# EAGLE design epic2 (EAGLE 6.5.0)
AUTHOR: Brad Campbell; REVISION: A; TITLE: Myth

## Sheet 1 of 2
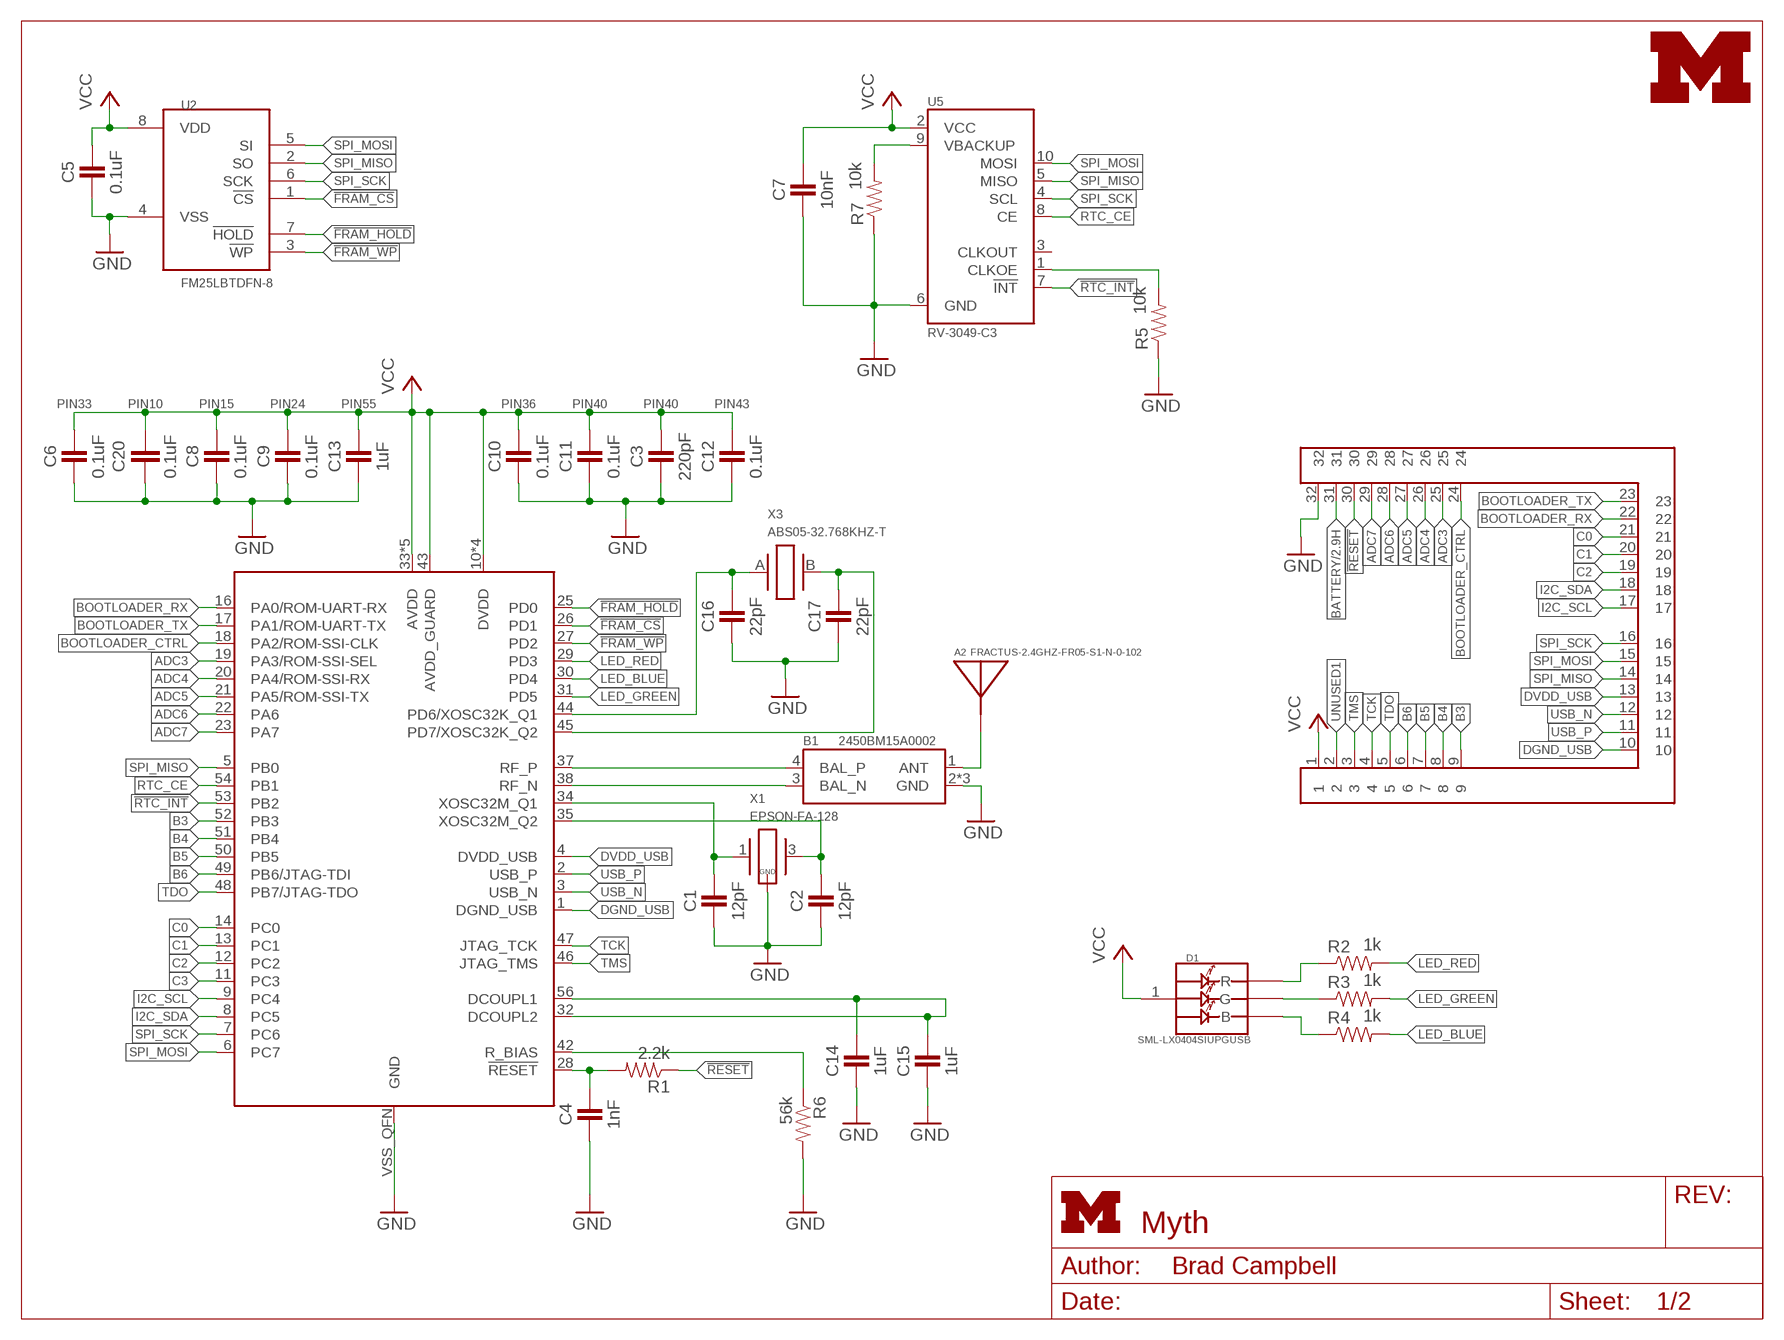
[diagram p0: schematic, sheet 1]
FRAME1 (LETTER_L): HEIGHT: 8.5in; WIDTH: 11in

### Parts
A2  FRACTUS-2.4GHZ-FR05-S1-N-0-102  [FRACTUS-ANTENNA-FR05-S1-N-0-102]
B1  2450BM15A0002  [2450BM]
C1  12pF  CAPACITOR  [0402_CAP]
C2  12pF  CAPACITOR  [0402_CAP]
C3  220pF  CAPACITOR  [0402_CAP]
C4  1nF  CAPACITOR  [0402_CAP]
C5  0.1uF  CAPACITOR  [0402_CAP]
C6  0.1uF  CAPACITOR  [0402_CAP]
C7  10nF  CAPACITOR  [0402_CAP]
C8  0.1uF  CAPACITOR  [0402_CAP]
C9  0.1uF  CAPACITOR  [0402_CAP]
C10  0.1uF  CAPACITOR  [0402_CAP]
C11  0.1uF  CAPACITOR  [0402_CAP]
C12  0.1uF  CAPACITOR  [0402_CAP]
C13  1uF  CAPACITOR  [0402_CAP]
C14  1uF  CAPACITOR  [0402_CAP]
C15  1uF  CAPACITOR  [0402_CAP]
C16  22pF  CAPACITOR  [0402_CAP]
C17  22pF  CAPACITOR  [0402_CAP]
C20  0.1uF  C-EUC0201  [C0201]
D1  SML-LX0404SIUPGUSB  [1MM_SQ_4PAD]
J1  EPIC2-HEADER2  [EPIC2-HEADER2]
LOGO1  UMICH_SOLID_TINY  [UMICH_SOLID_50MIL]
R1  2.2k  RESISTOR  [0402_RES]
R2  1k  RESISTOR  [0402_RES]
R3  1k  RESISTOR  [0402_RES]
R4  1k  RESISTOR  [0402_RES]
R5  10k  RESISTOR  [0402_RES]
R6  56k  RESISTOR  [0402_RES]
R7  10k  RESISTOR  [0402_RES]
U2  FM25LBTDFN-8  [TDFN-8]
U3  CC2538  [S-PVQFN-N56]
U5  RV-3049-C3  [MICRO-CRYSTAL-C3]
X1  EPSON-FA-128  [FA-128]
X3  ABS05-32.768KHZ-T  [ABS05]

### Nets
!FRAM_CS: U2.1(!CS) U3.26(PD1)
!FRAM_HOLD: U2.7(!HOLD) U3.25(PD0)
!FRAM_WP: U2.3(!WP) U3.27(PD2)
!RESET: J1.30 R1.1
!RTC_INT: U3.53(PB2) U5.7(!INT)
ADC3: J1.25 U3.19(PA3/ROM-SSI-SEL)
ADC4: J1.26 U3.20(PA4/ROM-SSI-RX)
ADC5: J1.27 U3.21(PA5/ROM-SSI-TX)
ADC6: J1.28 U3.22(PA6)
ADC7: J1.29 U3.23(PA7)
ANTENNA: A2.1(ANTENNA) B1.1(ANT)
B3: J1.9 U3.52(PB3)
B4: J1.8 U3.51(PB4)
B5: J1.7 U3.50(PB5)
B6: J1.6 U3.49(PB6/JTAG-TDI)
BATTERY: J1.31 ; also sheet 2
BOOTLOADER_CTRL: J1.24 U3.18(PA2/ROM-SSI-CLK)
BOOTLOADER_RX: J1.22 U3.16(PA0/ROM-UART-RX)
BOOTLOADER_TX: J1.23 U3.17(PA1/ROM-UART-TX)
C0: J1.21 U3.14(PC0)
C1: J1.20 U3.13(PC1)
C2: J1.19 U3.12(PC2)
C3: U3.11(PC3)
DGND_USB: J1.10 U3.1(DGND_USB)
DVDD_USB: J1.13 U3.4(DVDD_USB)
GND: B1.2(GND) B1.5(GND) B1.6(GND) C1.2 C2.2 C3.2 C4.2 C5.2 C6.2 C7.2 C8.2 C9.2 C10.2 C11.2 C12.2 C13.2 C14.2 C15.2 C16.2 C17.2 C20.2 J1.32 R5.1 R6.2 R7.1 U2.4(VSS) U3.VSS_QFN(GND) U5.6(GND) X1.2(GND) X1.4(GND) ; also sheet 2
I2C_SCL: J1.17 U3.9(PC4)
I2C_SDA: J1.18 U3.8(PC5)
LED_BLUE: R4.2 U3.30(PD4)
LED_GREEN: R3.2 U3.31(PD5)
LED_RED: R2.2 U3.29(PD3)
N$1: C4.1 R1.2 U3.28(!RESET)
N$6: C16.1 U3.44(PD6/XOSC32K_Q1) X3.A
N$7: D1.2(R) R2.1
N$8: R6.1 U3.42(R_BIAS)
N$9: C1.1 U3.34(XOSC32M_Q1) X1.1
N$10: C2.1 U3.35(XOSC32M_Q2) X1.3
N$11: D1.4(G) R3.1
N$12: D1.3(B) R4.1
N$13: C17.1 U3.45(PD7/XOSC32K_Q2) X3.B
N$14: R7.2 U5.9(VBACKUP)
N$15: C14.1 C15.1 U3.32(DCOUPL2) U3.56(DCOUPL1)
N$16: R5.2 U5.1(CLKOE)
RF_N: B1.3(BAL_N) U3.38(RF_N)
RF_P: B1.4(BAL_P) U3.37(RF_P)
RTC_CE: U3.54(PB1) U5.8(CE)
SPI_MISO: J1.14 U2.2(SO) U3.5(PB0) U5.5(MISO)
SPI_MOSI: J1.15 U2.5(SI) U3.6(PC7) U5.10(MOSI)
SPI_SCK: J1.16 U2.6(SCK) U3.7(PC6) U5.4(SCL)
TCK: J1.4 U3.47(JTAG_TCK)
TDO: J1.5 U3.48(PB7/JTAG-TDO)
TMS: J1.3 U3.46(JTAG_TMS)
UNUSED1: J1.2
USB_N: J1.12 U3.3(USB_N)
USB_P: J1.11 U3.2(USB_P)
VCC: C3.1 C5.1 C6.1 C7.1 C8.1 C9.1 C10.1 C11.1 C12.1 C13.1 C20.1 D1.1(VDD) J1.1 U2.8(VDD) U3.10(DVDD) U3.15(DVDD) U3.24(DVDD) U3.33(AVDD) U3.36(AVDD) U3.39(AVDD) U3.40(AVDD) U3.41(AVDD) U3.43(AVDD_GUARD) U3.55(DVDD) U5.2(VCC) ; also sheet 2
Unconnected: U5.3(CLKOUT)

### Notes on the sheet
- PIN33 | PIN10 | PIN15 | PIN24 | PIN55 | PIN36 | PIN40 | PIN40 | PIN43

## Sheet 2 of 2
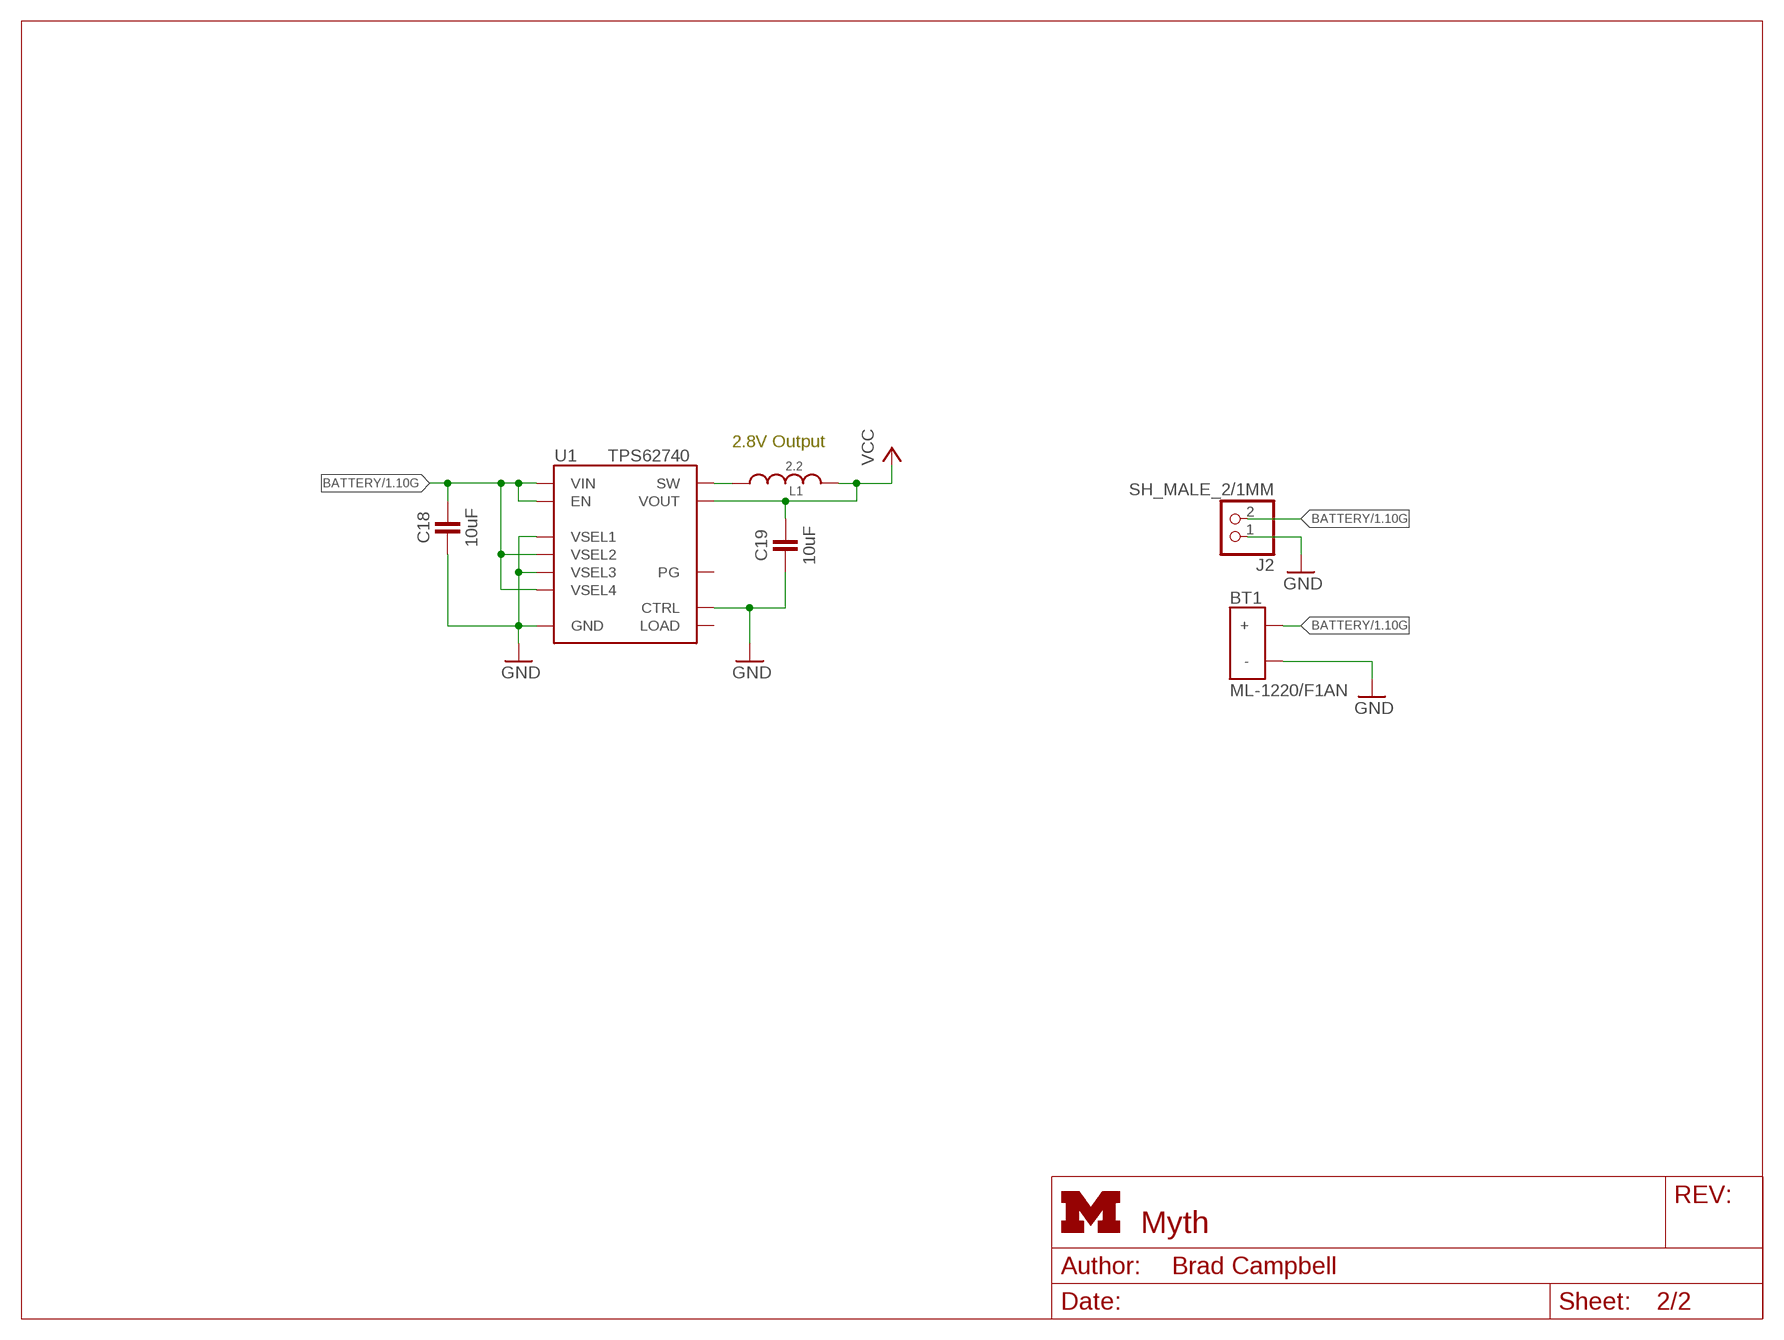
[diagram p1: schematic, sheet 2]
FRAME2 (LETTER_L): HEIGHT: 8.5in; WIDTH: 11in

### Parts
BT1  ML-1220/F1AN  [ML-1220/F1BN]
C18  10uF  CAPACITOR0603_CAP  [0603_CAP]
C19  10uF  CAPACITOR0603_CAP  [0603_CAP]
J2  SH_MALE_2/1MM  [SH-1X2/1MM]
L1  2.2  MIPSZ2012D  [MIPSZ201D]
U1  TPS62740  [R-PWSON-12]

### Nets
BATTERY: BT1.POS(+) C18.1 J2.2 U1.1(VIN) U1.8(VSEL4) U1.10(VSEL2) U1.12(EN) ; also sheet 1
GND: BT1.NEG(-) C18.2 C19.2 J2.1 U1.3(GND) U1.4(CTRL) U1.9(VSEL3) U1.11(VSEL1) U1.NC(GND) ; also sheet 1
N$5: L1.1 U1.2(SW)
VCC: C19.1 L1.2 U1.5(VOUT) ; also sheet 1
Unconnected: U1.6(LOAD) U1.7(PG)

### Notes on the sheet
- 2.8V Output

## Library data of the parts
A2 = chips:FRACTUS-2.4GHZ-FR05-S1-N-0-102: Fractus Compact Reach XtendTM chip antenna is engineered specifically for Bluetooth, WLAN 802.11 b/g/n and other wireless devices operating at the ISM 2.4 GHz band. Compact Reach Xtend combines small form factor size and high performance to improve the functionality of your wireless devices.; RICHARDSON_RFPD: FR05-S1-N-0102B
B1 = chips:2450BM15A0002: BALUN JTI MATCHED ZIGBEE; DIGIKEY: 712-1536-1-ND
BT1 = batteries:ML-1220/F1AN: BATTERY LITH 3V RECHARGE PC PINS; DIGIKEY: P663-nd; MOUSER: 658-ML-1220/F1BN
C1-C17 = passives:CAPACITOR: 0402 Capacitor
C18 = passives:CAPACITOR: 0402 Capacitor; DIGIKEY: 490-7316-1-ND
C19 = passives:CAPACITOR: 0402 Capacitor; DIGIKEY: 1276-1119-1-ND
C20 = rcl:C-EU: CAPACITOR, European symbol
D1 = leds:SML-LX0404SIUPGUSB: 1mm^2 RGB LED; DIGIKEY: 67-2125-1-ND
J1 = epic2:EPIC2-HEADER2
J2 = headers:SH_MALE_2/1MM: 1.0mm pitch/Disconnectable Crimp style connectors; DIGIKEY: 455-1788-2-ND
L1 = passives:MIPSZ2012D: FDK Multi-layer Power Inductor : MIPSZ2012D series (Very Small Type)
LOGO1 = logos:UMICH_SOLID
R1-R7 = passives:RESISTOR: Resistor Basic schematic elements and footprints for 0603, 1206, and PTH resistors.
U1 = chips:TPS62740: 360nA Step Down Converter for Low Power Applications; DIGIKEY: 296-37134-1-ND; MOUSER: 595-TPS62740DSST; NEWARK: 27X9745
U2 = chips:FM25LB: IC FRAM 4KBIT 10MHZ 8SOIC; DIGIKEY: FM25L04B-DGRA-ND; MOUSER: 877-FM25L04B-DG
U3 = chips:CC2538: A Powerful System-On-Chip for 2.4-GHz IEEE 802.15.4, 6LoWPAN and ZigBee Applications; DIGIKEY: 296-35797-1-ND; MOUSER: 595-CC2538SF53RTQT; NEWARK: 87W7713
U5 = chips:RV-3049-C3: The RV-3049-C3 is an ultra miniature Real-Time-Clock Module with embedded Crystal. This RTC has an SPI Bus (4-wire Serial- Interface) and offers temperature compensated time.
X1 = crystals:EPSON-FA-128: MHz RANGE CRYSTAL UNIT ULTRA MINIATURE SIZE LOW PROFILE SMD http://www.digikey.com/product-search/en?FV=ffec63d1
X3 = crystals:ABS05-32.768KHZ: 32.768kHz Crystal; DIGIKEY: 535-11899-1-ND

## Board
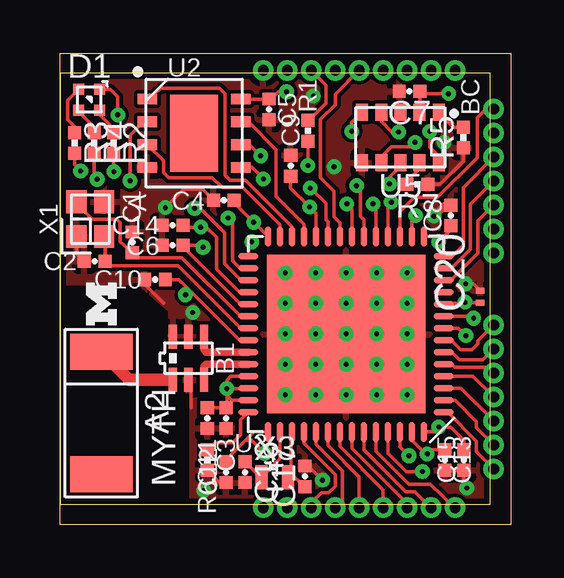
[diagram p2: board, top side]
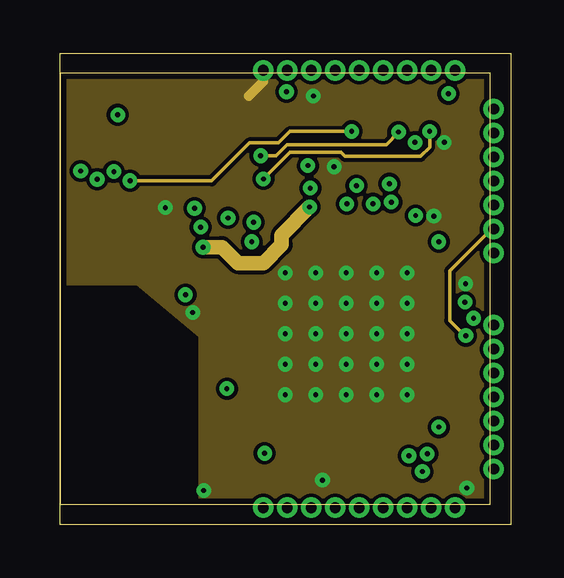
[diagram p3: board, inner layer Route2]
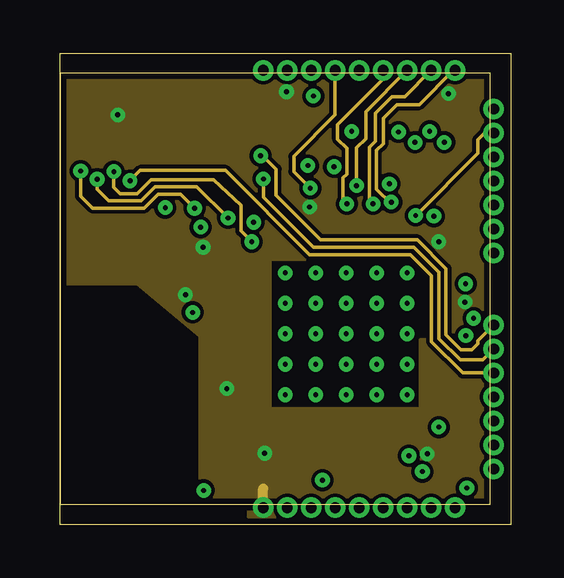
[diagram p4: board, inner layer Route15]
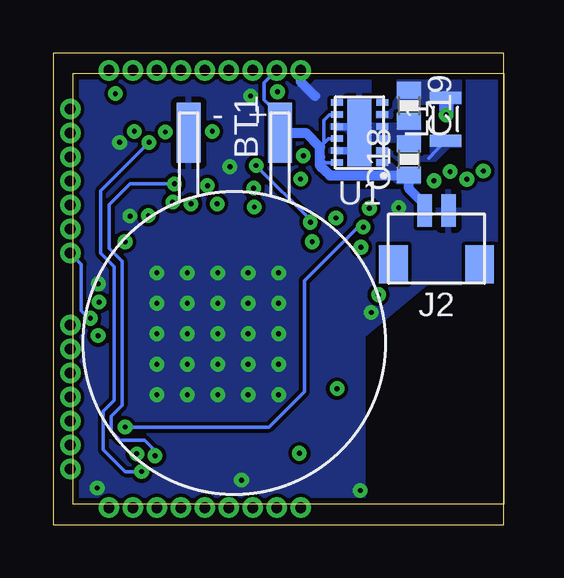
[diagram p5: board, bottom side, seen from below]

Size 17.96 x 17.96 mm. Coordinates in mm from the lower left corner, seen from the top.
Outline: 0,0 17.96,0 17.96,17.96 0,17.96 0,0
Copper layers (1+2*15+16): Top 0.0178mm / dielectric 12mil / Route2 0.0356mm / dielectric 28mil / Route15 0.0356mm / dielectric 12mil / Bottom 0.0178mm
Design rules "sunstone-4lyr_v1.0.0.3 *": minimum track width 6mil, minimum drill 8mil, track to track 6mil, track to pad 6mil, pad to pad 6mil, via to via 6mil, smd to smd 6mil, copper to edge 10mil, drill to drill 16mil, minimum pad ring 8mil, minimum via ring 8mil, stop-mask expansion 3mil, vias tented up to drill 8mil, thermal gap 10mil
Milling: 4 lines

### Footprints (pad centres in the part's own frame; a part is rotated, then mirrored left to right if it is on the bottom)
FRACTUS-ANTENNA-FR05-S1-N-0-102 = smd 1.5 x 2.6: 1 -2.55,0; 2 2.55,0
2450BM = smd 0.35 x 1: 1 0.65,0.9; 2 0,0.9; 3 -0.65,0.9; 4 -0.65,-0.9; 5 0,-0.9; 6 0.65,-0.9
ML-1220/F1BN = smd 2.5 x 1: NEG 8.75,1.9; POS 8.75,-1.9
0402_CAP = smd 0.536 x 0.546: 1 -0.433,0; 2 0.433,0
0603_CAP = smd 0.7 x 1: 1 -0.65,0; 2 0.65,0
C0201 = smd 0.25 x 0.35: 1 -0.25,0; 2 0.25,0
1MM_SQ_4PAD = smd 0.457 x 0.457: 1 0.432,0.432; 2 0.432,-0.432; 3 -0.432,-0.432; 4 -0.432,0.432
EPIC2-HEADER2 = drill 0.45 pad 0.8: 1 -9.479,-9.112; 2 -8.479,-9.112; 3 -7.479,-9.112; 4 -6.479,-9.112; 5 -5.479,-9.112; 6 -4.479,-9.112; 7 -3.479,-9.112; 8 -2.479,-9.112; 9 -1.479,-9.112; 10 0.133,-7.5; 11 0.133,-6.5; 12 0.133,-5.5; 13 0.133,-4.5; 14 0.133,-3.5; 15 0.133,-2.5; 16 0.133,-1.5; 17 0.133,1.5; 18 0.133,2.5; 19 0.133,3.5; 20 0.133,4.5; 21 0.133,5.5; 22 0.133,6.5; 23 0.133,7.5; 24 -1.479,9.112; 25 -2.479,9.112; 26 -3.479,9.112; 27 -4.479,9.112; 28 -5.479,9.112; 29 -6.479,9.112; 30 -7.479,9.112; 31 -8.479,9.112; 32 -9.479,9.112
SH-1X2/1MM = smd 0.6 x 1.35: 1 -0.5,0.1; 2 0.5,0.1 | smd 1.2 x 1.6: SUPPORT1 -1.8,2.335; SUPPORT2 1.8,2.335
MIPSZ201D = smd 0.5 x 1.3: 1 -0.9,0; 2 0.9,0
0402_RES = smd 0.536 x 0.546: 1 -0.433,0; 2 0.433,0
R-PWSON-12 = smd 0.28 x 0.5: 1 -1.25,-0.95; 2 -0.75,-0.95; 3 -0.25,-0.95; 4 0.25,-0.95; 5 0.75,-0.95; 6 1.25,-0.95; 7 1.25,0.95; 8 0.75,0.95; 9 0.25,0.95; 10 -0.25,0.95; 11 -0.75,0.95; 12 -1.25,0.95 | smd 2.8 x 1: NC 0,0
TDFN-8 = smd 0.45 x 0.8: 1 -1.425,-1.95; 2 -0.475,-1.95; 3 0.475,-1.95; 4 1.425,-1.95; 5 1.425,1.95; 6 0.475,1.95; 7 -0.475,1.95; 8 -1.425,1.95 | smd 3.2 x 2: NC 0,0
S-PVQFN-N56 = smd 0.85 x 0.28: 1 -4.075,3.25; 2 -4.075,2.75; 3 -4.075,2.25; 4 -4.075,1.75; 5 -4.075,1.25; 6 -4.075,0.75; 7 -4.075,0.25; 8 -4.075,-0.25; 9 -4.075,-0.75; 10 -4.075,-1.25; 11 -4.075,-1.75; 12 -4.075,-2.25; 13 -4.075,-2.75; 14 -4.075,-3.25; 29 4.075,-3.25; 30 4.075,-2.75; 31 4.075,-2.25; 32 4.075,-1.75; 33 4.075,-1.25; 34 4.075,-0.75; 35 4.075,-0.25; 36 4.075,0.25; 37 4.075,0.75; 38 4.075,1.25; 39 4.075,1.75; 40 4.075,2.25; 41 4.075,2.75; 42 4.075,3.25 | smd 0.28 x 0.85: 15 -3.25,-4.075; 16 -2.75,-4.075; 17 -2.25,-4.075; 18 -1.75,-4.075; 19 -1.25,-4.075; 20 -0.75,-4.075; 21 -0.25,-4.075; 22 0.25,-4.075; 23 0.75,-4.075; 24 1.25,-4.075; 25 1.75,-4.075; 26 2.25,-4.075; 27 2.75,-4.075; 28 3.25,-4.075; 43 3.25,4.075; 44 2.75,4.075; 45 2.25,4.075; 46 1.75,4.075; 47 1.25,4.075; 48 0.75,4.075; 49 0.25,4.075; 50 -0.25,4.075; 51 -0.75,4.075; 52 -1.25,4.075; 53 -1.75,4.075; 54 -2.25,4.075; 55 -2.75,4.075; 56 -3.25,4.075 | smd 6.6 x 6.6: VSS_QFN 0,0
MICRO-CRYSTAL-C3 = smd 0.5 x 0.7: 1 -1.6,-1.05; 2 -0.8,-1.05; 3 0,-1.05; 4 0.8,-1.05; 5 1.6,-1.05; 6 1.6,1.05; 7 0.8,1.05; 8 0,1.05; 9 -0.8,1.05; 10 -1.6,1.05
FA-128 = smd 0.95 x 0.85: 1 -0.725,-0.575; 2 0.725,-0.575; 3 0.725,0.575; 4 -0.725,0.575
ABS05 = smd 0.5 x 1: A -0.55,0; B 0.55,0

### Placement (x,y rotation side)
A2  1.73,3.81 270 top
B1  5.36,6.09 180 top
BT1  11.25,6.73 90 bottom
C1  3.02,10.92 90 top
C2  1.45,10.13 180 top
C3  6.93,3.6 270 top
C4  6.83,12.67 180 top
C5  8.71,16.46 270 top
C6  4.7,10.79 180 top
C7  14.58,17.22 180 top
C8  16.31,12.04 90 top
C9  9.62,14.12 90 top
C10  3.96,9.37 180 top
C11  6.15,3.6 270 top
C12  6.93,1.35 270 top
C13  16.05,1.85 270 top
C14  4.7,11.63 180 top
C15  16.85,1.85 270 top
C16  7.72,1.35 270 top
C17  10.21,1.17 90 top
C18  3.96,14.38 90 bottom
C19  3.96,16.61 270 bottom
C20  17.53,8.66 90 top
D1  1.22,16.87 0 top
J1  17.96,8.98 0 top
J2  2.82,12.34 180 bottom
L1  2.44,16.05 90 bottom
LOGO1  1.73,8.36 90 top
R1  10.34,15.57 270 top
R2  2.24,15.06 270 top
R3  0.61,15.06 270 top
R4  1.42,15.06 270 top
R5  16.81,15.29 90 top
R6  6.15,1.85 270 top
R7  14.91,13.34 180 top
U1  6.02,15.49 90 bottom
U2  5.6,15.47 270 top
U3  11.93,7.09 180 top
U5  14.2,15.29 180 top
X1  1.27,11.89 270 top
X3  8.97,1.14 0 top

### Tracks (layer width: path | path; a pad name or v marks a point on that pad's centre or on a via)
!FRAM_CS
  Top 0.152: U3.26 9.68,11.58 7.75,13.51 7.09,13.51 6.88,13.72 6.88,17.12 6.66,17.35 4.23,17.35 U2.1
!FRAM_HOLD
  Top 0.152: U3.25 10.19,11.68 9.02,12.85 9.02,14.78 7.86,15.94 U2.7
!FRAM_WP
  Top 0.152: U2.3 4.32,14.32 4.32,13.82 4.52,13.61 6.35,13.61 6.76,13.21 7.62,13.21 9.18,11.65 U3.27
!RESET
  Top 0.152: R1.1 10.39,16 11.1,16.71 11.1,17.47 J1.30
!RTC_INT  (via drill 0.2)
  Top 0.152: U3.53 13.68,2.14 14.45,1.37 v15.11,1.37 | U5.7 13.4,14.49 13.82,14.91 14.63,14.91 v14.81,15.09
  Bottom 0.152: v15.11,1.37 15.8,1.37 16.71,2.29 16.71,3.89 16.26,4.34 16.26,9.91 16.82,10.46 16.82,13.08 v14.81,15.09
ADC3  (via drill 0.2)
  Top 0.152: U3.19 13.18,12.4 v13.06,12.52
  Route15 0.152: v13.06,12.52 12.9,12.68 12.9,14.88 13.16,15.14 13.16,16.31 13.84,16.99 14.38,16.99 J1.25
ADC4  (via drill 0.2)
  Top 0.152: U3.20 12.68,11.86 12.52,12.01 12.52,13.13 v12.37,13.28
  Route15 0.152: v12.37,13.28 12.37,14.86 12.75,15.24 12.75,16.36 J1.26
ADC5  (via drill 0.2)
  Top 0.152: U3.21 12.18,12.31 v11.96,12.52
  Route15 0.152: v11.96,12.52 11.81,12.68 11.81,13.61 11.96,13.77 11.96,14.83 11.58,15.21 11.58,15.82 13.48,17.72 J1.27
ADC6
  Top 0.152: U3.22 11.68,11.74 11.43,11.99 11.43,13.06 10.87,13.61 10.87,16.05 11.48,16.66 11.48,17.09 J1.28
ADC7  (via drill 0.2)
  Top 0.152: U3.23 11.18,11.78 11.1,11.86 11.1,12.55 v10.44,13.18 | 11.35,17.97 J1.29
  Route15 0.152: v10.44,13.18 9.75,13.87 9.75,14.5 11.48,16.23 J1.29
ANTENNA
  Top 0.254: B1.1 4.56,5.19
  Top 0.531: A2.1 2.89,5.19 4.56,5.19
B3
  Top 0.152: U3.52 13.18,2.21 14.55,0.84 15.44,0.84 J1.9
B4
  Top 0.152: U3.51 12.68,2.28 14.43,0.53 14.81,0.53 J1.8
B5
  Top 0.152: U3.50 12.18,2.35 14.48,0.05 J1.7
B6
  Top 0.152: U3.49 11.68,2.42 13.48,0.62 J1.6
BATTERY
  Bottom 0.152: U1.10 7.31,15.24 7.49,15.06 | U1.12 7.44,14.24 7.67,14.48 | 7.49,15.06 7.67,14.88 | U1.8 7.28,16.24 7.52,16 7.52,15.09 7.49,15.06 | BT1.POS 9.35,16.21 10.01,16.87 10.01,17.56 J1.31
  Bottom 0.406: BT1.POS 8.27,15.48 7.67,14.88 7.67,14.48 7.67,14.1 7.26,13.72 3.97,13.72 C18.1 3.96,13.16 3.32,12.51 J2.2
  pour Bottom (no thermals): 3.48,13.34 3.48,14.05 4.47,14.05 4.85,14.4 5.33,14.4 5.33,14.1 5.03,13.79 4.5,13.34
BOOTLOADER_CTRL  (via drill 0.2)
  Top 0.152: U3.18 13.68,12.36 v13.82,12.6
  Route15 0.152: v13.82,12.6 13.82,12.52 13.21,13.13 13.21,14.76 13.49,15.04 13.49,16.1 14.05,16.66 14.99,16.66 16.41,18.09 J1.24
BOOTLOADER_RX  (via drill 0.2)
  Top 0.152: U3.16 14.68,11.89 v14.83,12.04
  Route15 0.152: v14.83,12.04 17.42,14.63 17.42,15.19 17.71,15.48 J1.22
BOOTLOADER_TX
  Top 0.152: U3.17 14.18,12.2 14.78,12.8 15.75,12.8 17.4,14.45 17.4,16.1 17.77,16.48 J1.23
C0
  Top 0.152: 16.05,10.35 U3.14 16.36,10.35 16.82,10.79 16.82,13.2 J1.21
C1
  Top 0.152: U3.13 16.32,9.85 17.12,10.64 17.12,12.51 J1.20
C2
  Top 0.152: U3.12 16.31,9.35 17.42,10.46 17.42,11.81 J1.19
DGND_USB
  Top 0.152: 16.35,3.85 U3.1 16.17,3.85 17.37,2.64 17.37,2.2 J1.10 17.77,1.48
DVDD_USB
  Top 0.152: J1.13 17.23,5.34 U3.4
GND  (via drill 0.2)
  Top 0.152: C20.2 17.24,9.2 v16.92,9.2 | C2.2 0.69,10.45 X1.2 | C13.2 C15.2 16.85,0.8 v16.97,0.69 | C10.2 3.53,9.17 4.32,8.38 | R7.1 15.85,13.34 16.82,14.3 R5.1 16.82,14.94 | 16.23,12.5 C8.2 | B1.2 5.46,5.09 5.46,4.04 | C12.2 6.66,0.91 R6.2 | v10.95,1.02 10.39,1.58 C17.2 | C4.2 5.94,13.13 5.16,13.13 v4.39,12.37
  Top 0.305: v15.6,12.01 16.08,12.47 C8.2
  Route2 0.406: J1.32 8.48,17.62 7.87,17.02
  Bottom 0.305: U1.9 6.27,15.74 U1.NC | 5.77,15.74 U1.NC | U1.11 6.34,14.74 6.02,15.06 U1.NC
  Bottom 0.406: J1.32 8.48,17.62 7.87,17.02
  other vias: 11.94,7.11 13.21,7.11 14.48,7.11 11.94,8.38 11.94,9.65 13.21,8.38 14.48,8.38 13.21,9.65 14.48,9.65 9.4,8.38 9.4,9.65 10.67,8.38 10.67,9.65 10.67,7.11 9.4,7.11 9.4,5.84 9.4,4.57 10.67,4.57 10.67,5.84 11.94,4.57 11.94,5.84 13.21,4.57 13.21,5.84 14.48,4.57 14.48,5.84 5.54,8 10.57,17.02 11.43,14.07 5.99,0.58 16.03,15.09
  pour Top: 0,17.96 17.96,17.96 17.96,0 5.46,0 5.46,4.7 5.21,4.7 5.21,5.59 6.32,5.59 6.32,5.28 8.26,5.31 8.26,6.99 4.57,6.99 4.57,8.08 3.28,9.19 0,9.19
  pour Bottom: 5.59,17.96 17.96,17.96 17.96,0 5.84,0 5.84,7.01 3.23,9.19 0,9.19 0,18.03 1.52,18.03 1.52,13.08 6.1,13.08 6.1,16.76 5.59,16.76
  pour Route2 (no thermals): 0,17.96 17.96,17.96 17.96,0 5.84,0 5.84,7.01 3.23,9.19 0,9.19
  pour Bottom (no thermals): 3.45,15.9 6.1,15.9 6.1,15.06 3.45,15.06
I2C_SCL  (via drill 0.2)
  Top 0.152: U3.9 17.16,7.84 v17.25,7.76
  Bottom 0.152: J1.17 17.63,10.02 17.63,8.06 17.32,7.76 v17.25,7.76
I2C_SDA  (via drill 0.2)
  Top 0.152: v16.93,7.04 16.62,7.34 U3.8
  Route2 0.152: J1.18 18.01,11.48 16.26,9.73 16.26,7.66 16.88,7.04 v16.93,7.04
LED_BLUE  (via drill 0.2)
  Top 0.152: U3.30 7.5,9.85 7.19,10.16 7.19,11.76 v7.01,11.94 | R4.2 1.42,13.68 v1.55,13.55
  Route15 0.152: v7.01,11.94 5.69,13.23 3.96,13.23 3.38,12.65 2.03,12.65 1.55,13.13 v1.55,13.55
LED_GREEN  (via drill 0.2)
  Top 0.152: U3.31 7.55,9.35 6.86,10.03 6.86,11.33 5.84,12.34 v5.61,12.34 | R3.2 0.61,14.15 v0.86,13.89
  Route15 0.152: v5.61,12.34 5.03,12.93 4.09,12.93 3.5,12.34 1.37,12.34 0.86,12.85 v0.86,13.89
LED_RED  (via drill 0.2)
  Top 0.152: U3.29 7.86,10.8 v8,10.95 | v2.25,13.87 R2.2
  Route15 0.152: v8,10.95 7.54,11.4 7.54,12.47 6.4,13.54 3.81,13.54 3.23,12.95 2.52,12.95 2.25,13.22 v2.25,13.87
N$1  (via drill 0.2)
  Top 0.152: U3.28 v8.09,11.76 v8.08,11.76 7.29,12.55 C4.1 | R1.2 v10.34,14.12
  Bottom 0.152: v8.08,11.76 8.08,11.86 v10.34,14.12
N$5
  Bottom 0.152: 3.14,14.43 L1.1
  pour Bottom (no thermals): 5.33,14.88 4.85,14.88 4.47,14.58 3.1,14.58 3.1,15.39 1.78,15.34 1.78,14.86 2.26,14.86 2.84,14.27 4.42,14.27 4.8,14.58 5.33,14.58
N$6
  Top 0.152: C16.1 8.36,1.14 X3.A 9.18,1.91 U3.44
N$7
  Top 0.152: D1.2 1.65,16.23 2.23,15.65 R2.1
N$8
  Top 0.152: R6.1 6.15,2.23 6.48,2.56 7.2,2.56 7.53,2.9 7.53,3.52 U3.42
N$9
  Top 0.152: 7.83,7.87 U3.34 7.52,7.84 5.08,10.29 3.17,10.29 C1.1 2.52,10.95 2.52,11.73 2.36,11.89 1.34,11.89 0.77,12.46 X1.1
N$10
  Top 0.152: X1.3 1.88,11.12 C2.1 2.06,9.96 4.93,9.96 7.54,7.34 U3.35
N$11
  Top 0.152: D1.4 0.33,16.84 0.33,16.03 0.61,15.75 R3.1
N$12
  Top 0.152: D1.3 0.79,16.36 1.42,15.72 R4.1
N$13
  Top 0.152: U3.45 9.63,2.97 9.63,1.25 X3.B 9.78,1.14 C17.1
N$14
  Top 0.152: R7.2 14.48,13.46 15,13.98 U5.9
N$15  (via drill 0.2)
  Top 0.152: U3.32 7.49,8.85 6.53,9.8 6.53,11.12 6.1,11.56 v5.87,11.56 5.21,11.56 C14.1 5.21,11.63 | U3.56 15.59,3.02 v15.8,3.23 16.31,3.23 16.85,2.68 C15.1
  Bottom 0.152: v15.8,3.23 9.8,3.23 8.33,4.7 8.33,9.32 6.1,11.56 v5.87,11.56
N$16
  Top 0.152: 15.87,16.34 U5.1 16.42,15.72 R5.2
RF_N
  Top 0.302: U3.38 6.1,5.84 6.01,5.75 B1.3
  Top 0.305: U3.38
RF_P
  Top 0.302: U3.37 6.1,6.34 6.01,6.44 B1.4
RTC_CE  (via drill 0.2)
  Top 0.152: U5.8 14.19,14.09 13.74,13.64 v13.74,13.36 | U3.54 14.18,2.41 v14.55,2.03
  Bottom 0.152: v13.74,13.36 15.6,13.36 16.46,12.5 16.46,10.67 15.93,10.13 15.93,4.14 16.38,3.68 16.38,3.05 16,2.67 14.99,2.67 14.55,2.23 v14.55,2.03
SPI_MISO  (via drill 0.2)
  Top 0.152: U3.5 16.33,5.84 16.46,5.71 17.86,5.71 J1.14 | U2.2 3.47,15.94 2.92,15.39 v2.92,13.49 | U5.5 12.17,15.91 v12.17,15.54
  Route2 0.152: v12.17,15.54 9.6,15.54 9.12,15.06 7.9,15.06 6.33,13.49 v2.92,13.49
  Route15 0.152: J1.14 16.8,5.48 15.49,6.78 15.49,9.53 14.61,10.41 10.41,10.41 6.91,13.92 3.35,13.92 v2.92,13.49
SPI_MOSI  (via drill 0.2)
  Top 0.152: U2.5 7.9,14.04 | 7.93,14.04 U2.5 | v8.48,13.56 8,14.04 U2.5 | 16.31,6.34 U3.6 16.34,6.34 16.66,6.02 17.63,6.02 J1.15 | U5.10 15.8,14.5 15.42,14.88 v15.42,15.54
  Route2 0.152: v8.48,13.56 9.6,14.68 11.71,14.68 11.89,14.5 15.04,14.5 15.42,14.88 v15.42,15.54
  Route15 0.152: v8.48,13.56 8.48,12.8 10.57,10.72 14.76,10.72 15.8,9.68 15.8,6.91 16.69,6.02 17.63,6.02 J1.15
SPI_SCK  (via drill 0.2)
  Top 0.152: 7.87,14.99 U2.6 7.9,14.99 v8.37,14.53 | 16.29,6.84 U3.7 16.32,6.84 16.71,6.45 17.17,6.45 17.42,6.71 17.42,6.81 J1.16 | U5.4 13.4,15.96 13.84,15.52 v14.12,15.52
  Route2 0.152: v14.12,15.52 13.61,14.99 9.47,14.99 9.02,14.53 v8.37,14.53
  Route15 0.152: J1.16 17.42,6.81 17.42,6.71 17.17,6.45 16.71,6.45 16.1,7.06 16.1,9.83 14.91,11.02 10.87,11.02 9.02,12.88 9.02,13.97 8.46,14.53 v8.37,14.53
TCK
  Top 0.152: U3.47 10.68,2.5 11.79,1.4 11.79,0.11 J1.4
TDO
  Top 0.152: U3.48 11.18,2.46 12.48,1.16 J1.5
TMS
  Top 0.152: 10.18,2.72 U3.46 | 10.18,2.75 U3.46 | 10.18,2.67 U3.46 | U3.46 10.18,2.54 11.48,1.25 11.48,0.76 11.2,0.48 10.9,0.48 10.48,0.07 J1.3
USB_N
  Top 0.152: J1.12 16.73,4.84 U3.3
USB_P
  Top 0.152: J1.11 17.37,3.2 17.37,3.45 16.48,4.34 U3.2
VCC  (via drill 0.2)
  Top 0.152: C11.1 C3.1 6.96,4.06 v6.96,4.83 | U3.41 7.16,4.34 6.96,4.55 v6.96,4.83 | U3.39 7.12,5.34 6.96,5.18 v6.96,4.83 | U3.40 7.84,4.83 v6.96,4.83 | C12.1 6.97,1.9 7.74,2.67 | 7.74,2.67 8.09,3.02 U3.43 | U3.15 15.58,11.17 v15.8,10.95 16.31,11.46 C8.1 | U2.8 8.81,16.89 | 8.81,16.89 C5.1 | v8.53,2.13 8,2.67 7.74,2.67 | U3.10 16.04,8.38 16.84,8.38 v16.89,8.43 16.92,8.41 C20.1 | C7.1 15.01,16.35 U5.2 | U3.55 14.68,2.67 15.24,2.11 v15.32,2.11 15.49,2.29 C13.1 | U3.36 7.48,6.84 5.23,9.09 | C10.1 4.95,9.37 5.23,9.09 | U3.33 7.53,8.35 5.13,10.74 C6.1 5.89,10.79 v5.97,10.72 | 5.23,9.09 v5.23,8.74 | U3.24 10.68,12.13 v10.41,12.39 9.62,13.19 C9.1 | C7.1 15.06,17.2 | v16.2,17.12 15.14,17.12 C7.1 | 8.81,16.89 9.11,17.2 v9.45,17.2 | D1.1 2.09,17.3 2.41,16.98 v2.41,16.23
  Route2 0.61: v5.97,10.72 6.76,10.72 7.42,10.06 8.48,10.06 9.25,10.82 9.25,11.23 v10.41,12.39
  Route15 0.406: J1.1 8.48,0.67
  Bottom 0.61: L1.2 2.41,16.93 v2.41,16.23
  pour Route15 (no thermals): 0,17.96 17.96,17.96 17.96,6.35 17.02,6.35 16,7.37 14.99,7.37 14.99,10.21 8.76,10.21 8.76,3.99 15.04,3.99 15.04,6.86 15.75,6.86 17.96,5.49 17.96,0 9.14,0 9.14,-0.51 7.87,-0.51 7.87,0 5.84,0 5.84,7.01 3.23,9.19 0,9.19
  pour Bottom (no thermals): 5.33,16.08 4.67,16.08 4.34,16.66 1.75,16.66 1.75,17.7 4.5,17.7 4.5,17.07 4.8,16.41 5.33,16.41

### Text on the board
tPlace: BC | A | MYTH
bPlace: + | -